# Altium schematic sheet Sema.SchDoc
size A
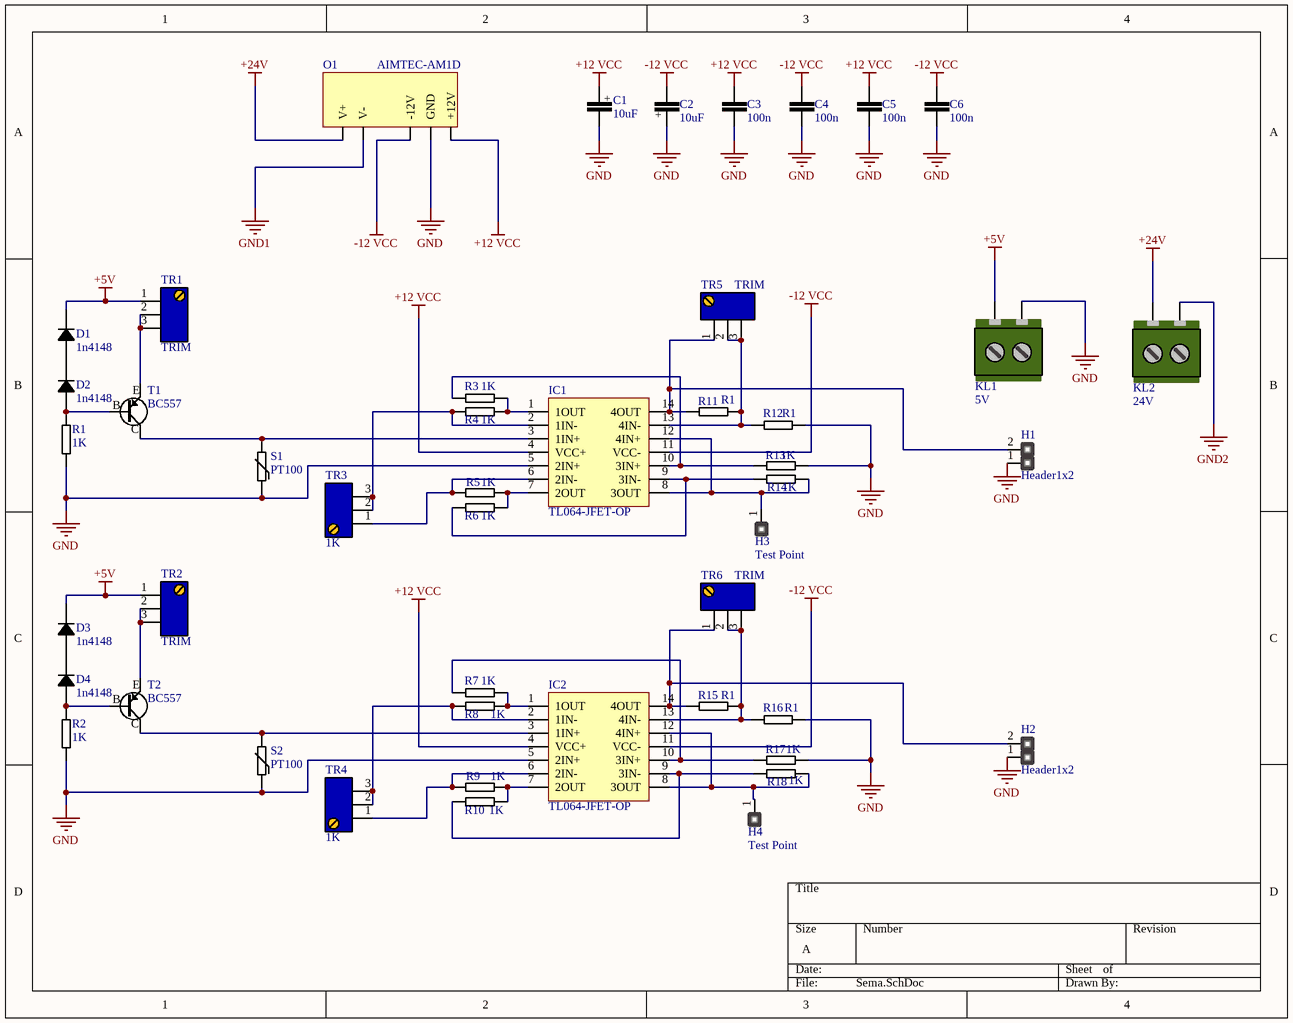
[diagram p0: Sema.SchDoc]

## Parts
C1  10uF  [C2-Small]
C2  10uF  [C2-Small]
C3  100n  [C1(Ceramic)Small]
C4  100n  [C1(Ceramic)Small]
C5  100n  [C1(Ceramic)Small]
C6  100n  [C1(Ceramic)Small]
D1  1n4148  [D1(minimelf)]
D2  1n4148  [D1(minimelf)]
D3  1n4148  [D1(minimelf)]
D4  1n4148  [D1(minimelf)]
H1  Header1x2  [Header1x2]
H2  Header1x2  [Header1x2]
H3  Test Point  [H1x1]
H4  Test Point  [H1x1]
IC1  TL064-JFET-OP  [DIP14]
IC2  TL064-JFET-OP  [DIP14]
KL1  5V  [Klema]
KL2  24V  [Klema]
O1  AIMTEC-AM1D  [Aimtec-AM1D]
R1  1K  [R 0805]
R2  1K  [R 0805]
R3  1K  [R 0805]
R4  1K  [R 0805]
R5  1K  [R 0805]
R6  1K  [R 0805]
R7  1K  [R 0805]
R8  1K  [R 0805]
R9  1K  [R 0805]
R10  1K  [R 0805]
R11  R1  [R 0805]
R12  R1  [R 0805]
R13  1K  [R 0805]
R14  1K  [R 0805]
R15  R1  [R 0805]
R16  R1  [R 0805]
R17  1K  [R 0805]
R18  1K  [R 0805]
S1  PT100  [Header1x2]
S2  PT100  [Header1x2]
T1  BC557  [sot23]
T2  BC557  [sot23]
TR1  TRIM  [TRIM]
TR2  TRIM  [TRIM]
TR3  1K  [TRIM]
TR4  1K  [TRIM]
TR5  TRIM  [TRIM]
TR6  TRIM  [TRIM]

## Nets
+5V: D1.2 D3.2 KL1.2 TR1.1 TR2.1
+12 VCC: C1.1 C3.2 C5.2 IC1.4(VCC+) IC2.4(VCC+) O1.5(+12V)
+24V: KL2.2 O1.1(V+)
-12 VCC: C2.2 C4.2 C6.2 IC1.11(VCC-) IC2.11(VCC-) O1.3(-12V)
GND: C1.2 C2.1 C3.1 C4.1 C5.1 C6.1 H1.1 H2.1 IC1.5(2IN+) IC2.5(2IN+) KL1.1 O1.4(GND) R1.1 R2.1 R12.2 R13.1 R16.2 R17.1 S1.2 S2.2
GND1: O1.2(V-)
GND2: KL2.1
NetD1_1: D1.1 D2.2
NetD2_1: D2.1 R1.2 T1.1
NetD3_1: D3.1 D4.2
NetD4_1: D4.1 R2.2 T2.1
NetH1_2: H1.2 IC1.14(4OUT) R11.1 TR5.1
NetH2_2: H2.2 IC2.14(4OUT) R15.1 TR6.1
NetH3_1: H3.1 IC1.8(3OUT) IC1.12(4IN+) R14.2
NetH4_1: H4.1 IC2.8(3OUT) IC2.12(4IN+) R18.2
NetIC1_1: IC1.1(1OUT) R3.2 R4.1
NetIC1_2: IC1.2(1IN-) R4.2 TR3.2 TR3.3
NetIC1_3: IC1.3(1IN+) S1.1 T1.3
NetIC1_6: IC1.6(2IN-) R5.1 TR3.1
NetIC1_7: IC1.7(2OUT) R5.2 R6.1
NetIC1_9: IC1.9(3IN-) R6.2 R14.1
NetIC1_10: IC1.10(3IN+) R3.1 R13.2
NetIC1_13: IC1.13(4IN-) R11.2 R12.1 TR5.2 TR5.3
NetIC2_1: IC2.1(1OUT) R7.2 R8.1
NetIC2_2: IC2.2(1IN-) R8.2 TR4.2 TR4.3
NetIC2_3: IC2.3(1IN+) S2.1 T2.3
NetIC2_6: IC2.6(2IN-) R9.1 TR4.1
NetIC2_7: IC2.7(2OUT) R9.2 R10.1
NetIC2_9: IC2.9(3IN-) R10.2 R18.1
NetIC2_10: IC2.10(3IN+) R7.1 R17.2
NetIC2_13: IC2.13(4IN-) R15.2 R16.1 TR6.2 TR6.3
NetT1_2: T1.2 TR1.2 TR1.3
NetT2_2: T2.2 TR2.2 TR2.3

## Notes on the sheet
- (in symbol C2) +
- (in symbol Transistor PNP) E; B; C

## Library data of the parts
C1 C2 = C2
C3-C6 = C1
D1-D4 = D1
H3 H4 = H1x1
KL1 KL2 = Klema
R1-R10 R13 R14 R17 R18 = R1
T1 T2 = Transistor PNP
TR3 TR4 = TRIM